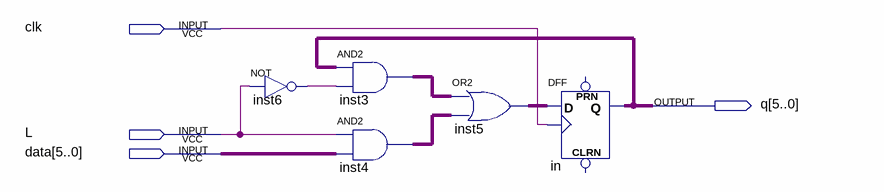
[diagram p0: schematic sheet]
// Quartus schematic reg_6.bdf as structural Verilog: 5 symbols, 4 pins
module reg_6 (
  input  clk,
  input  L,
  input  [5:0] data,
  output [5:0] q
);

  wire inst6_out;
  wire [5:0] inst3_out, inst4_out, inst5_out;

  not inst6 (inst6_out, L);
  assign inst3_out = q & {6{inst6_out}};  // AND2 inst3, 6 bits wide
  assign inst4_out = {6{L}} & data;  // AND2 inst4, 6 bits wide
  assign inst5_out = inst3_out | inst4_out;  // OR2 inst5, 6 bits wide
  DFF in[5:0] (.CLK(clk), .D(inst5_out), .Q(q));  // open: CLRN, PRN
endmodule
